# Altium schematic sheet ieee_hart_receiver.schdoc: reciever
size 277 x 295 mm; Device: Altium_Custom(1091*1162); Revision: 1.0; DocumentSize: User; date: 18032008; project: Penguino-STM32WL-LoRa-E5; file: Penguino-STM32WL-LoRa-E5.schdoc; size: User; Name: Altium_Custom(1091*1162); Width: 1091; Height: 1162; X Region Count: 0; Y Region Count: 0; Blade Width: 0; Region Start: 1; Border: 1; Title Block Position: 3
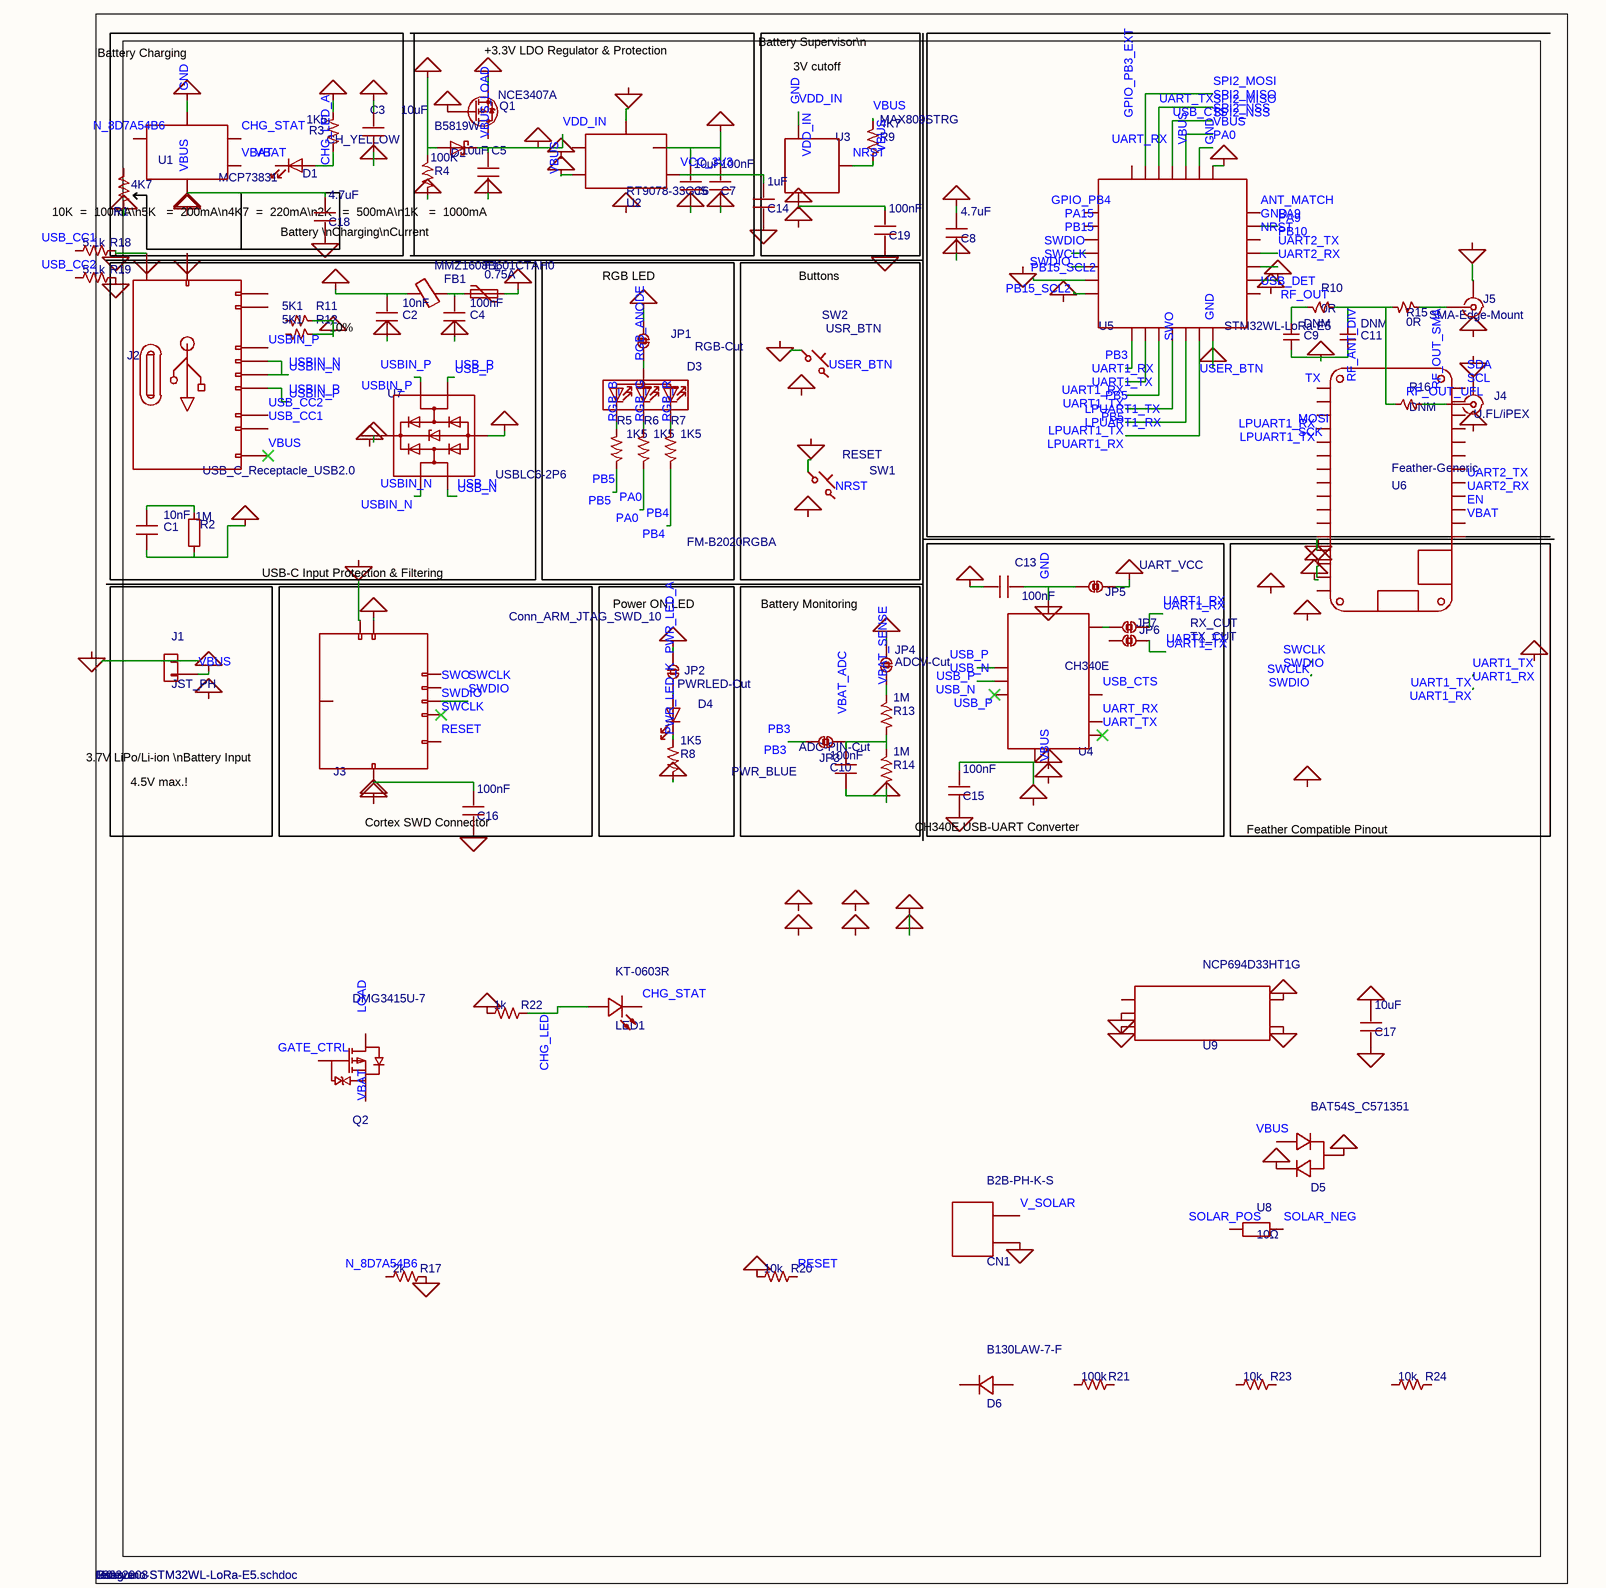
[diagram p0: ieee_hart_receiver.schdoc]

## Parts
C1  value 10nF  (hidden comment: Protoflow:Device_C)
C2  value 10nF  (hidden comment: Protoflow:Device_C_2)
C3  value 10uF  (hidden comment: Protoflow:Device_C_5)
C4  value 100nF  (hidden comment: Protoflow:Device_C_3)
C5  value 10uF  (hidden comment: Protoflow:Device_C_6)
C6  value 10uF  (hidden comment: Protoflow:Device_C_8)
C7  value 100nF  (hidden comment: Protoflow:Device_C_7)
C8  value 4.7uF  (hidden comment: Protoflow:Device_C_10)
C9  value DNM  (hidden comment: Protoflow:Device_C_Small)
C10  value 100nF  (hidden comment: Protoflow:Device_C_4)
C11  value DNM  (hidden comment: Protoflow:Device_C_Small_2)
C13  value 100nF  (hidden comment: Protoflow:Device_C_9)
C14  value 1uF  (hidden comment: Device:C)
C15  value 100nF  (hidden comment: Device:C)
C16  value 100nF  (hidden comment: Device:C)
C17  value 10uF  (hidden comment: Device:C)
C18  value 4.7uF  (hidden comment: Device:C)
C19  value 100nF  (hidden comment: Device:C)
CN1  B2B-PH-K-S
D1  value CH_YELLOW  (hidden comment: Protoflow:Device_LED_ALT_2)
D2  value B5819W  (hidden comment: Protoflow:Diode_MBR0520)
D3  value FM-B2020RGBA  (hidden comment: Protoflow:Penguino-STM32WL-LoRa-E5-rescue_RGB_LED_FM-B2020RGBA-tinylora_v1-TLM-4260-breakout-v1_0-rescue-TinyLoRa-4260-breakout-v1_0-rescu)
D4  value PWR_BLUE  (hidden comment: Protoflow:Device_LED_ALT)
D5  value BAT54S_C571351  (hidden comment: Protoflow:BAT54S_C571351)
D6  value B130LAW-7-F  (hidden comment: Protoflow:B130LAW-7-F)
F1  value 0.75A  (hidden comment: Protoflow:Device_Polyfuse)
FB1  value MMZ1608B601CTAH0  (hidden comment: Protoflow:Device_Ferrite_Bead)
J1  value JST_PH  (hidden comment: Protoflow:Connector_Generic_Conn_01x02)
J2  value USB_C_Receptacle_USB2.0  (hidden comment: Protoflow:Penguino-STM32WL-LoRa-E5-rescue_USB_C_Receptacle_USB2_0-Connector-Penguino-STM32WL-M-rescue)
J3  value Conn_ARM_JTAG_SWD_10  (hidden comment: Protoflow:Connector_Conn_ARM_JTAG_SWD_10)
J4  value U.FL/iPEX  (hidden comment: Protoflow:Connector_Conn_Coaxial)
J5  value SMA-Edge-Mount  (hidden comment: Protoflow:Connector_Conn_Coaxial_2)
JP1  value RGB-Cut  (hidden comment: Protoflow:Jumper_SolderJumper_2_Bridged)
JP2  value PWRLED-Cut  (hidden comment: Protoflow:Jumper_SolderJumper_2_Bridged_2)
JP3  value ADC-PIN-Cut  (hidden comment: Protoflow:Jumper_SolderJumper_2_Bridged_3)
JP4  value ADCV-Cut  (hidden comment: Protoflow:Jumper_SolderJumper_2_Bridged_4)
JP5  value UART_VCC  (hidden comment: Protoflow:Jumper_SolderJumper_2_Bridged_5)
JP6  value RX_CUT  (hidden comment: Protoflow:Jumper_SolderJumper_2_Bridged_7)
JP7  value TX_CUT  (hidden comment: Protoflow:Jumper_SolderJumper_2_Bridged_6)
LED1  value KT-0603R  (hidden comment: Protoflow:KT-0603R)
Q1  value NCE3407A  (hidden comment: Protoflow:Device_Q_PMOS_GSD)
Q2  value DMG3415U-7  (hidden comment: Protoflow:DMG3415U-7)
R1  value 4K7  (hidden comment: Protoflow:Device_R_US_2)
R2  value 1M  (hidden comment: Protoflow:Device_R)
R3  value 1K5  (hidden comment: Protoflow:Device_R_US)
R4  value 100K  (hidden comment: Protoflow:Device_R_US_3)
R5  value 1K5  (hidden comment: Protoflow:Device_R_US_7)
R6  value 1K5  (hidden comment: Protoflow:Device_R_US_8)
R7  value 1K5  (hidden comment: Protoflow:Device_R_US_9)
R8  value 1K5  (hidden comment: Protoflow:Device_R_US_6)
R9  value 4K7  (hidden comment: Protoflow:Device_R_US_10)
R10  value 0R  (hidden comment: Protoflow:Device_R_Small_US)
R11  value 5K1  (hidden comment: Protoflow:Device_R_Small_US_4)
R12  value 5K1  (hidden comment: Protoflow:Device_R_Small_US_5)
R13  value 1M  (hidden comment: Protoflow:Device_R_US_4)
R14  value 1M  (hidden comment: Protoflow:Device_R_US_5)
R15  value 0R  (hidden comment: Protoflow:Device_R_Small_US_3)
R16  value DNM  (hidden comment: Protoflow:Device_R_Small_US_2)
R17  value 2k  (hidden comment: Device:R_US)
R18  value 5.1k  (hidden comment: Device:R_US)
R19  value 5.1k  (hidden comment: Device:R_US)
R20  value 10k  (hidden comment: Device:R_US)
R21  value 100k  (hidden comment: Device:R_US)
R22  value 1k  (hidden comment: Device:R_US)
R23  value 10k  (hidden comment: Device:R_US)
R24  value 10k  (hidden comment: Device:R_US)
SW1  value RESET  (hidden comment: Protoflow:Switch_SW_Push_45deg_2)
SW2  value USR_BTN  (hidden comment: Protoflow:Switch_SW_Push_45deg)
U1  value MCP73831  (hidden comment: Protoflow:Battery_Management_MCP73831-2-OT)
U2  value RT9078-33GJ5  (hidden comment: Protoflow:Regulator_Linear_NCV8114ASN120T1G)
U3  value MAX809STRG  (hidden comment: Protoflow:Power_Supervisor_TPS3839DBZ)
U4  value CH340E  (hidden comment: Protoflow:Interface_USB_CH340E)
U5  value STM32WL-LoRa-E5  (hidden comment: Protoflow:stm32wl-lib-v1_STM32WL-LoRa-E5)
U6  value Feather-Generic  (hidden comment: Protoflow:penguino_v1_Feather-Generic)
U7  value USBLC6-2P6  (hidden comment: Protoflow:Power_Protection_USBLC6-2P6)
U8  value 10Ω  (hidden comment: Protoflow:FR1_2W-10_5_)
U9  value NCP694D33HT1G  (hidden comment: Protoflow:NCP694D33HT1G)

## Blocks framed on the sheet
RGB LED: D3 JP1 R5-R7
Buttons: SW1 SW2
CH340E USB-UART Converter: C13 C15 JP5-JP7 U4
Cortex SWD Connector: C16 J3
Power ON LED: D4 JP2 R8
Battery Monitoring: C10 JP3 JP4 R13 R14

## Nets
+3.3V: C17.1 D5.3(K/A) R20.1 U5.20(PB10) U6.2(3V) U9.5(VOUT)
GND: C13.2 C14.2 C15.2 C16.2 C17.2 C18.2 C19.2 CN1.2 J2.A1(GND) J2.A12(GND) J2.B1(GND) J2.B12(GND) J2.S1(SHIELD) JP5.2(B) R17.2 R18.2 R19.2 U4.3(GND) U6.4(GND) U9.2(GND) U9.3(CE) U9.4(VIN)
power_+3.3V: C2.2 C5.2 C6.2 C7.2 C8.2 D2.1(K) FB1.2 J3.3(GND) J3.5(GND) JP1.1(A) JP2.1(A) JP5.1(A) U2.4(NC)  [also labelled power_PWR_FLAG]
power_+BATT: C3.2 J1.1(Pin_1) JP4.1(A) Q1.2(S)
power_GND: C1.2 C2.1 C3.1 C4.1 C5.1 C6.1 C7.1 C8.1 C9.1 C10.2 C11.1 C13.1 R1.1 R2.2 R4.1 R8.1 R11.2 R12.2 R14.1 U5.14(GND) U5.22(GND)
power_VBUS: D2.2(A) F1.1 R3.2 R4.2 U1.2(VSS) U7.2(GND)
VBAT: D5.2(K) Q1.1(G)
VBUS: R9.2 R22.1 U2.1(IN)
CHG_LED: LED1.1(A) R22.2
LPUART1_RX: U5.23(PA0) U6.14(Rx)  [also labelled USER_BTN]
LPUART1_TX: U5.24(PB13) U6.13(MISO)
PA0: R6.1
PA9: U5.16(GND)
PB3: JP3.1(A)
PB4: R7.1
PB5: R5.1 U5.25(PB9)
PB15_SCL2: U5.2(GND)
RF_ANT_DIV: C11.2 R10.2 R15.1 R16.2
RF_OUT_SMA: J5.1(In) R15.2
SPI2_MISO: U5.10(PB6)
SPI2_NSS: U5.11(PB5)
SWCLK: J3.4(SWDCLK/TCK)
SWDIO: J3.2(SWDIO/TMS) U5.4(PA14)
UART1_RX: JP6.1(A) U5.27(PA10)
UART1_TX: JP7.1(A) U5.26(PB14)
USB_N: U4.2(UD-) U7.3(I/O2)
USB_P: U4.1(UD+) U4.6(TNOW) U7.1(I/O1)
USBIN_N: J2.A6(D+) J2.B7(D-) U7.4(I/O2)
USBIN_P: J2.A7(D-) J2.B6(D+) U7.6(I/O1)
VDD_IN: U3.1(GND)
NetC1_1: C1.1 R2.1
NetC4_2: C4.2 F1.2 FB1.1
NetC9_2: C9.2 R10.1
NetC10_1: C10.1 JP3.2(B) R13.1 R14.2
NetC14_1: C14.1 U2.5(OUT)
NetC15_1: C15.1 U4.10(V3)
NetC16_1: C16.1 J3.1(VTref)
NetC18_1: C18.1 U1.4(VDD)
NetC19_1: C19.1 U3.3(VDD)
NetD1_2: D1.2(A) R3.1
NetD3_1: D3.1(RK) R7.2
NetD3_2: D3.2(BK) R5.2
NetD3_3: D3.3(A) JP1.2(B)
NetD3_4: D3.4(GK) R6.2
NetD4_1: D4.1(K) R8.2
NetD4_2: D4.2(A) JP2.2(B)
NetJ2_A4: J2.A4(VBUS) J2.A9(VBUS) J2.B4(VBUS) J2.B9(VBUS)
NetJ4_1: J4.1(In) R16.1
NetJP4_2: JP4.2(B) R13.2
NetJP6_2: JP6.2(B) U4.4(~{RTS})
NetR9_1: R9.1 U3.2(~{RESET})

Not connected (* = marked no-connect by the designer): CN1 1; D1 1(K); D5 1(A); D6 1 2; J1 2(Pin_2); J2 A5(CC1) A8(SBU1) B5(CC2) B8(SBU2); J3 6(SWO/TDO) 7(KEY) 8(NC/TDI) 9(GNDDetect) 10(~{RESET}); J4 2(Ext); J5 2(Ext); JP7 2(B); LED1 2(K); Q1 3(D); Q2 1(G) 2(D) 3(S); R1 2; R11 1; R12 1; R17 1; R18 1; R19 1; R20 2; R21 1 2; R23 1 2; R24 1 2; SW1 1 2; SW2 1 2; U1 1(STAT) 3(VBAT) 5(PROG); U2 2(GND) 3(EN); U4 5(~{CTS}) 7(VCC) 8(TXD)* 9(RXD); U5 1(VCC) 3(PA13) 5(PB15) 6(PA15) 7(PB4) 8(PB3) 9(PB7) 12(PC1) 13(PC0) 15(RFIO) 17(RST) 18(PA3) 19(PA2) 21(PA9) 28(PB0); U6 1(RST) 3 5 6 7 8 9 10 11(SCK) 12(MOSI) 15(Tx) 16 17(SDA) 18(SCL) 19 20 21 22 23 24 25 26(VBUS) 27(EN) 28(VBAT); U7 5(VBUS); U8 1 2; U9 1(ADJ/NC)

## Notes on the sheet
- Battery Charging
- (near Q1) +3.3V LDO Regulator & Protection
- Battery Supervisor\n
- 3V cutoff
- 10K  =  100mA\n5K   =  200mA\n4K7  =  220mA\n2K   =  500mA\n1K   =  1000mA
- (near C18) Battery \nCharging\nCurrent
- 10%
- USB-C Input Protection & Filtering
- 4.5V max.!
- 3.7V LiPo/Li-ion \nBattery Input
- Feather Compatible Pinout
- Labels drawn without touching a wire or pin: +3.3V, ANT_MATCH, CHG_LED_A, CHG_STAT, EN, GATE_CTRL, GND, GPIO_PB3_EXT, GPIO_PB4, LOAD, LPUART1_RX, LPUART1_TX, MOSI, N_8D7A54B6, NRST, PA0, PA9, PA15, PB3, PB4, PB5, PB10, PB15, PB15_SCL2, power_+3.3V, power_GND, power_PWR_FLAG, power_VBUS, PWR_LED_A, PWR_LED_K, RESET, RF_OUT, RF_OUT_UFL, RGB_ANODE, RGB_B, RGB_G, RGB_R, SCK, SCL, SDA, SOLAR_NEG, SOLAR_POS, SPI2_MISO, SPI2_MOSI, SPI2_NSS, SWCLK, SWDIO, SWO, TX, UART1_RX, UART1_TX, UART2_RX, UART2_TX, UART_RX, UART_TX, USB_CC1, USB_CC2, USB_CTS, USB_DET, USB_N, USB_P, USBIN_N, USBIN_P, USER_BTN, V_SOLAR, VBAT, VBAT_ADC, VBAT_SENSE, VBUS, VBUS_LOAD, VCC_3V3, VDD_IN
- reciever
- 1.0
- User
- 18032008
- Penguino-STM32WL-LoRa-E5
- Penguino-STM32WL-LoRa-E5.schdoc

## Library data of the parts
C1 = Protoflow:Device_C: UniqueId: b4693cfd16d534cd; AddInBom: yes; Device: Protoflow:Device_C; DesignItemID: Protoflow:Device_C; LibraryName: ProtoFlow; SymbolName: Protoflow:Device_C
C2 = Protoflow:Device_C_2: UniqueId: a2c5d49bc5dde298; AddInBom: yes; Device: Protoflow:Device_C_2; DesignItemID: Protoflow:Device_C_2; LibraryName: ProtoFlow; SymbolName: Protoflow:Device_C_2
C3 = Protoflow:Device_C_5: UniqueId: cc82bf2c2e22e605; AddInBom: yes; Device: Protoflow:Device_C_5; DesignItemID: Protoflow:Device_C_5; LibraryName: ProtoFlow; SymbolName: Protoflow:Device_C_5
C4 = Protoflow:Device_C_3: UniqueId: 3a68d3ddabf48558; AddInBom: yes; Device: Protoflow:Device_C_3; DesignItemID: Protoflow:Device_C_3; LibraryName: ProtoFlow; SymbolName: Protoflow:Device_C_3
C5 = Protoflow:Device_C_6: UniqueId: ddba3c46cf8b8e66; AddInBom: yes; Device: Protoflow:Device_C_6; DesignItemID: Protoflow:Device_C_6; LibraryName: ProtoFlow; SymbolName: Protoflow:Device_C_6
C6 = Protoflow:Device_C_8: UniqueId: ab4a8fe24fad9fe4; AddInBom: yes; Device: Protoflow:Device_C_8; DesignItemID: Protoflow:Device_C_8; LibraryName: ProtoFlow; SymbolName: Protoflow:Device_C_8
C7 = Protoflow:Device_C_7: UniqueId: 48d2dd422533522c; AddInBom: yes; Device: Protoflow:Device_C_7; DesignItemID: Protoflow:Device_C_7; LibraryName: ProtoFlow; SymbolName: Protoflow:Device_C_7
C8 = Protoflow:Device_C_10: UniqueId: 80f3708378e3d903; AddInBom: yes; Device: Protoflow:Device_C_10; DesignItemID: Protoflow:Device_C_10; LibraryName: ProtoFlow; SymbolName: Protoflow:Device_C_10
C9 = Protoflow:Device_C_Small: UniqueId: 7ddfd2f632a8b17d; AddInBom: yes; Device: Protoflow:Device_C_Small; DesignItemID: Protoflow:Device_C_Small; LibraryName: ProtoFlow; SymbolName: Protoflow:Device_C_Small
C10 = Protoflow:Device_C_4: UniqueId: 3e75135af30e0f04; AddInBom: yes; Device: Protoflow:Device_C_4; DesignItemID: Protoflow:Device_C_4; LibraryName: ProtoFlow; SymbolName: Protoflow:Device_C_4
C11 = Protoflow:Device_C_Small_2: UniqueId: 20764de07767b3a1; AddInBom: yes; Device: Protoflow:Device_C_Small_2; DesignItemID: Protoflow:Device_C_Small_2; LibraryName: ProtoFlow; SymbolName: Protoflow:Device_C_Small_2
C13 = Protoflow:Device_C_9: UniqueId: e7ba3aba9f9889c8; AddInBom: yes; Device: Protoflow:Device_C_9; DesignItemID: Protoflow:Device_C_9; LibraryName: ProtoFlow; SymbolName: Protoflow:Device_C_9
C14 = Device:C: UniqueId: 00361082df9d4549; AddInBom: yes; Device: Device:C; DesignItemID: Device:C; LibraryName: ProtoFlow; SymbolName: Device:C
C15 = Device:C: UniqueId: 86bb77bda672094d; AddInBom: yes; Device: Device:C; DesignItemID: Device:C; LibraryName: ProtoFlow; SymbolName: Device:C
C16 = Device:C: UniqueId: c8e923f96b539988; AddInBom: yes; Device: Device:C; DesignItemID: Device:C; LibraryName: ProtoFlow; SymbolName: Device:C
C17 = Device:C: UniqueId: 48700c84863a802e; AddInBom: yes; Device: Device:C; DesignItemID: Device:C; LibraryName: ProtoFlow; SymbolName: Device:C
C18 = Device:C: UniqueId: d9d0285421fe3ef0; AddInBom: yes; Device: Device:C; DesignItemID: Device:C; LibraryName: ProtoFlow; SymbolName: Device:C
C19 = Device:C: UniqueId: 9b75bd895f0e39d2; AddInBom: yes; Device: Device:C; DesignItemID: Device:C; LibraryName: ProtoFlow; SymbolName: Device:C
CN1 = B2B-PH-K-S: UniqueId: f8333110677ba079; AddInBom: yes; Device: B2B-PH-K-S; Value: B2B-PH-K-S; DesignItemID: B2B-PH-K-S; LibraryName: ProtoFlow; SymbolName: B2B-PH-K-S
D1 = Protoflow:Device_LED_ALT_2: UniqueId: 6eb2f7ba7a12821c; AddInBom: yes; Device: Protoflow:Device_LED_ALT_2; DesignItemID: Protoflow:Device_LED_ALT_2; LibraryName: ProtoFlow; SymbolName: Protoflow:Device_LED_ALT_2
D2 = Protoflow:Diode_MBR0520: UniqueId: cca08e5caf06c018; AddInBom: yes; Device: Protoflow:Diode_MBR0520; DesignItemID: Protoflow:Diode_MBR0520; LibraryName: ProtoFlow; SymbolName: Protoflow:Diode_MBR0520
D3 = Protoflow:Penguino-STM32WL-LoRa-E5-rescue_RGB_LED_FM-B2020RGBA-tinylora_v1-TLM-4260-breakout-v1_0-rescue-TinyLoRa-4260-breakout-: UniqueId: 81689f1d3303caec; AddInBom: yes; Device: Protoflow:Penguino-STM32WL-LoRa-E5-rescue_RGB_LED_FM-B2020RGBA-tinylora_v1-TLM-4260-breakout-v1_0-rescue-TinyLoRa-4260-breakout-; DesignItemID: Protoflow:Penguino-STM32WL-LoRa-E5-rescue_RGB_LED_FM-B2020RGBA-tinylora_v1-TLM-4260-breakout-v1_0-rescue-TinyLoRa-4260-breakout-v1_0-rescu; LibraryName: ProtoFlow; SymbolName: Protoflow:Penguino-STM32WL-LoRa-E5-rescue_RGB_LED_FM-B2020RGBA-tinylora_v1-TLM-4260-breakout-v1_0-rescue-TinyLoRa-4260-breakout-
D4 = Protoflow:Device_LED_ALT: UniqueId: 6a4368da87585c93; AddInBom: yes; Device: Protoflow:Device_LED_ALT; DesignItemID: Protoflow:Device_LED_ALT; LibraryName: ProtoFlow; SymbolName: Protoflow:Device_LED_ALT
D5 = Protoflow:BAT54S_C571351: UniqueId: aa27cf4c2f614704; AddInBom: yes; Device: Protoflow:BAT54S_C571351; DesignItemID: Protoflow:BAT54S_C571351; LibraryName: ProtoFlow; SymbolName: Protoflow:BAT54S_C571351
D6 = Protoflow:B130LAW-7-F: UniqueId: 0b466d7a0d9696a1; AddInBom: yes; Device: Protoflow:B130LAW-7-F; DesignItemID: Protoflow:B130LAW-7-F; LibraryName: ProtoFlow; SymbolName: Protoflow:B130LAW-7-F
F1 = Protoflow:Device_Polyfuse: UniqueId: 09f31a4987c8a883; AddInBom: yes; Device: Protoflow:Device_Polyfuse; DesignItemID: Protoflow:Device_Polyfuse; LibraryName: ProtoFlow; SymbolName: Protoflow:Device_Polyfuse
FB1 = Protoflow:Device_Ferrite_Bead: UniqueId: 323bb55b4674cf0d; AddInBom: yes; Device: Protoflow:Device_Ferrite_Bead; DesignItemID: Protoflow:Device_Ferrite_Bead; LibraryName: ProtoFlow; SymbolName: Protoflow:Device_Ferrite_Bead
J1 = Protoflow:Connector_Generic_Conn_01x02: UniqueId: 51bfc0e5166a1c40; AddInBom: yes; Device: Protoflow:Connector_Generic_Conn_01x02; DesignItemID: Protoflow:Connector_Generic_Conn_01x02; LibraryName: ProtoFlow; SymbolName: Protoflow:Connector_Generic_Conn_01x02
J2 = Protoflow:Penguino-STM32WL-LoRa-E5-rescue_USB_C_Receptacle_USB2_0-Connector-Penguino-STM32WL-M-rescue: UniqueId: 1fb9863844ab5169; AddInBom: yes; Device: Protoflow:Penguino-STM32WL-LoRa-E5-rescue_USB_C_Receptacle_USB2_0-Connector-Penguino-STM32WL-M-rescue; DesignItemID: Protoflow:Penguino-STM32WL-LoRa-E5-rescue_USB_C_Receptacle_USB2_0-Connector-Penguino-STM32WL-M-rescue; LibraryName: ProtoFlow; SymbolName: Protoflow:Penguino-STM32WL-LoRa-E5-rescue_USB_C_Receptacle_USB2_0-Connector-Penguino-STM32WL-M-rescue
J3 = Protoflow:Connector_Conn_ARM_JTAG_SWD_10: UniqueId: bd3ee0abdb58119f; AddInBom: yes; Device: Protoflow:Connector_Conn_ARM_JTAG_SWD_10; DesignItemID: Protoflow:Connector_Conn_ARM_JTAG_SWD_10; LibraryName: ProtoFlow; SymbolName: Protoflow:Connector_Conn_ARM_JTAG_SWD_10
J4 = Protoflow:Connector_Conn_Coaxial: UniqueId: 7aadee231938cadd; AddInBom: yes; Device: Protoflow:Connector_Conn_Coaxial; DesignItemID: Protoflow:Connector_Conn_Coaxial; LibraryName: ProtoFlow; SymbolName: Protoflow:Connector_Conn_Coaxial
J5 = Protoflow:Connector_Conn_Coaxial_2: UniqueId: 188f82074eb8ca32; AddInBom: yes; Device: Protoflow:Connector_Conn_Coaxial_2; DesignItemID: Protoflow:Connector_Conn_Coaxial_2; LibraryName: ProtoFlow; SymbolName: Protoflow:Connector_Conn_Coaxial_2
JP1 = Protoflow:Jumper_SolderJumper_2_Bridged: UniqueId: 4fe8deccf3ecd12b; AddInBom: yes; Device: Protoflow:Jumper_SolderJumper_2_Bridged; DesignItemID: Protoflow:Jumper_SolderJumper_2_Bridged; LibraryName: ProtoFlow; SymbolName: Protoflow:Jumper_SolderJumper_2_Bridged
JP2 = Protoflow:Jumper_SolderJumper_2_Bridged_2: UniqueId: 12cb931c49908c91; AddInBom: yes; Device: Protoflow:Jumper_SolderJumper_2_Bridged_2; DesignItemID: Protoflow:Jumper_SolderJumper_2_Bridged_2; LibraryName: ProtoFlow; SymbolName: Protoflow:Jumper_SolderJumper_2_Bridged_2
JP3 = Protoflow:Jumper_SolderJumper_2_Bridged_3: UniqueId: 4577e3d3da87c365; AddInBom: yes; Device: Protoflow:Jumper_SolderJumper_2_Bridged_3; DesignItemID: Protoflow:Jumper_SolderJumper_2_Bridged_3; LibraryName: ProtoFlow; SymbolName: Protoflow:Jumper_SolderJumper_2_Bridged_3
JP4 = Protoflow:Jumper_SolderJumper_2_Bridged_4: UniqueId: d84cd54a2cd93ea0; AddInBom: yes; Device: Protoflow:Jumper_SolderJumper_2_Bridged_4; DesignItemID: Protoflow:Jumper_SolderJumper_2_Bridged_4; LibraryName: ProtoFlow; SymbolName: Protoflow:Jumper_SolderJumper_2_Bridged_4
JP5 = Protoflow:Jumper_SolderJumper_2_Bridged_5: UniqueId: 7ff5f6d6ea161ff3; AddInBom: yes; Device: Protoflow:Jumper_SolderJumper_2_Bridged_5; DesignItemID: Protoflow:Jumper_SolderJumper_2_Bridged_5; LibraryName: ProtoFlow; SymbolName: Protoflow:Jumper_SolderJumper_2_Bridged_5
JP6 = Protoflow:Jumper_SolderJumper_2_Bridged_7: UniqueId: 1e4a53fbbd604e66; AddInBom: yes; Device: Protoflow:Jumper_SolderJumper_2_Bridged_7; DesignItemID: Protoflow:Jumper_SolderJumper_2_Bridged_7; LibraryName: ProtoFlow; SymbolName: Protoflow:Jumper_SolderJumper_2_Bridged_7
JP7 = Protoflow:Jumper_SolderJumper_2_Bridged_6: UniqueId: 2c2198ed19c983b6; AddInBom: yes; Device: Protoflow:Jumper_SolderJumper_2_Bridged_6; DesignItemID: Protoflow:Jumper_SolderJumper_2_Bridged_6; LibraryName: ProtoFlow; SymbolName: Protoflow:Jumper_SolderJumper_2_Bridged_6
LED1 = Protoflow:KT-0603R: UniqueId: 7a65b453ee5a9ec2; AddInBom: yes; Device: Protoflow:KT-0603R; DesignItemID: Protoflow:KT-0603R; LibraryName: ProtoFlow; SymbolName: Protoflow:KT-0603R
Q1 = Protoflow:Device_Q_PMOS_GSD: UniqueId: f76c01de5337d462; AddInBom: yes; Device: Protoflow:Device_Q_PMOS_GSD; DesignItemID: Protoflow:Device_Q_PMOS_GSD; LibraryName: ProtoFlow; SymbolName: Protoflow:Device_Q_PMOS_GSD
Q2 = Protoflow:DMG3415U-7: UniqueId: 4c27cd76e8dbac26; AddInBom: yes; Device: Protoflow:DMG3415U-7; DesignItemID: Protoflow:DMG3415U-7; LibraryName: ProtoFlow; SymbolName: Protoflow:DMG3415U-7
R1 = Protoflow:Device_R_US_2: UniqueId: 353b166cc2dee846; AddInBom: yes; Device: Protoflow:Device_R_US_2; DesignItemID: Protoflow:Device_R_US_2; LibraryName: ProtoFlow; SymbolName: Protoflow:Device_R_US_2
R2 = Protoflow:Device_R: UniqueId: 6f63fc6711cfa315; AddInBom: yes; Device: Protoflow:Device_R; DesignItemID: Protoflow:Device_R; LibraryName: ProtoFlow; SymbolName: Protoflow:Device_R
R3 = Protoflow:Device_R_US: UniqueId: fe89d0632cfce75f; AddInBom: yes; Device: Protoflow:Device_R_US; DesignItemID: Protoflow:Device_R_US; LibraryName: ProtoFlow; SymbolName: Protoflow:Device_R_US
R4 = Protoflow:Device_R_US_3: UniqueId: fdc86a4b576d9e98; AddInBom: yes; Device: Protoflow:Device_R_US_3; DesignItemID: Protoflow:Device_R_US_3; LibraryName: ProtoFlow; SymbolName: Protoflow:Device_R_US_3
R5 = Protoflow:Device_R_US_7: UniqueId: 9cdd622c9eeecfe7; AddInBom: yes; Device: Protoflow:Device_R_US_7; DesignItemID: Protoflow:Device_R_US_7; LibraryName: ProtoFlow; SymbolName: Protoflow:Device_R_US_7
R6 = Protoflow:Device_R_US_8: UniqueId: e06ccd13940482ac; AddInBom: yes; Device: Protoflow:Device_R_US_8; DesignItemID: Protoflow:Device_R_US_8; LibraryName: ProtoFlow; SymbolName: Protoflow:Device_R_US_8
R7 = Protoflow:Device_R_US_9: UniqueId: ba2c6d155e7fd301; AddInBom: yes; Device: Protoflow:Device_R_US_9; DesignItemID: Protoflow:Device_R_US_9; LibraryName: ProtoFlow; SymbolName: Protoflow:Device_R_US_9
R8 = Protoflow:Device_R_US_6: UniqueId: 86d447fa2a9c8586; AddInBom: yes; Device: Protoflow:Device_R_US_6; DesignItemID: Protoflow:Device_R_US_6; LibraryName: ProtoFlow; SymbolName: Protoflow:Device_R_US_6
R9 = Protoflow:Device_R_US_10: UniqueId: 1e1ffada38203b9e; AddInBom: yes; Device: Protoflow:Device_R_US_10; DesignItemID: Protoflow:Device_R_US_10; LibraryName: ProtoFlow; SymbolName: Protoflow:Device_R_US_10
R10 = Protoflow:Device_R_Small_US: UniqueId: 41bc0941336b1513; AddInBom: yes; Device: Protoflow:Device_R_Small_US; DesignItemID: Protoflow:Device_R_Small_US; LibraryName: ProtoFlow; SymbolName: Protoflow:Device_R_Small_US
R11 = Protoflow:Device_R_Small_US_4: UniqueId: 763cf8d5648cb4fd; AddInBom: yes; Device: Protoflow:Device_R_Small_US_4; DesignItemID: Protoflow:Device_R_Small_US_4; LibraryName: ProtoFlow; SymbolName: Protoflow:Device_R_Small_US_4
R12 = Protoflow:Device_R_Small_US_5: UniqueId: 15ac9218146e0f4b; AddInBom: yes; Device: Protoflow:Device_R_Small_US_5; DesignItemID: Protoflow:Device_R_Small_US_5; LibraryName: ProtoFlow; SymbolName: Protoflow:Device_R_Small_US_5
R13 = Protoflow:Device_R_US_4: UniqueId: ff4077a9ca69db92; AddInBom: yes; Device: Protoflow:Device_R_US_4; DesignItemID: Protoflow:Device_R_US_4; LibraryName: ProtoFlow; SymbolName: Protoflow:Device_R_US_4
R14 = Protoflow:Device_R_US_5: UniqueId: 8b54177fc4d64d35; AddInBom: yes; Device: Protoflow:Device_R_US_5; DesignItemID: Protoflow:Device_R_US_5; LibraryName: ProtoFlow; SymbolName: Protoflow:Device_R_US_5
R15 = Protoflow:Device_R_Small_US_3: UniqueId: feece054417b9159; AddInBom: yes; Device: Protoflow:Device_R_Small_US_3; DesignItemID: Protoflow:Device_R_Small_US_3; LibraryName: ProtoFlow; SymbolName: Protoflow:Device_R_Small_US_3
R16 = Protoflow:Device_R_Small_US_2: UniqueId: 3c543c7c58e1cc80; AddInBom: yes; Device: Protoflow:Device_R_Small_US_2; DesignItemID: Protoflow:Device_R_Small_US_2; LibraryName: ProtoFlow; SymbolName: Protoflow:Device_R_Small_US_2
R17 = Device:R_US: UniqueId: 6346d187b4e0bc9c; AddInBom: yes; Device: Device:R_US; DesignItemID: Device:R_US; LibraryName: ProtoFlow; SymbolName: Device:R_US
R18 = Device:R_US: UniqueId: 5f673669f0d56d8f; AddInBom: yes; Device: Device:R_US; DesignItemID: Device:R_US; LibraryName: ProtoFlow; SymbolName: Device:R_US
R19 = Device:R_US: UniqueId: a32210a39874d8f8; AddInBom: yes; Device: Device:R_US; DesignItemID: Device:R_US; LibraryName: ProtoFlow; SymbolName: Device:R_US
R20 = Device:R_US: UniqueId: 13e77c54ede4b306; AddInBom: yes; Device: Device:R_US; DesignItemID: Device:R_US; LibraryName: ProtoFlow; SymbolName: Device:R_US
R21 = Device:R_US: UniqueId: c77b08197b178948; AddInBom: yes; Device: Device:R_US; DesignItemID: Device:R_US; LibraryName: ProtoFlow; SymbolName: Device:R_US
R22 = Device:R_US: UniqueId: fa394caafc8878d8; AddInBom: yes; Device: Device:R_US; DesignItemID: Device:R_US; LibraryName: ProtoFlow; SymbolName: Device:R_US
R23 = Device:R_US: UniqueId: d92c635076b33213; AddInBom: yes; Device: Device:R_US; DesignItemID: Device:R_US; LibraryName: ProtoFlow; SymbolName: Device:R_US
R24 = Device:R_US: UniqueId: f7952e9f9cd6773b; AddInBom: yes; Device: Device:R_US; DesignItemID: Device:R_US; LibraryName: ProtoFlow; SymbolName: Device:R_US
SW1 = Protoflow:Switch_SW_Push_45deg_2: UniqueId: c39dab7994ba8bcb; AddInBom: yes; Device: Protoflow:Switch_SW_Push_45deg_2; DesignItemID: Protoflow:Switch_SW_Push_45deg_2; LibraryName: ProtoFlow; SymbolName: Protoflow:Switch_SW_Push_45deg_2
SW2 = Protoflow:Switch_SW_Push_45deg: UniqueId: 5cf9f4a776b330ee; AddInBom: yes; Device: Protoflow:Switch_SW_Push_45deg; DesignItemID: Protoflow:Switch_SW_Push_45deg; LibraryName: ProtoFlow; SymbolName: Protoflow:Switch_SW_Push_45deg
U1 = Protoflow:Battery_Management_MCP73831-2-OT: UniqueId: 1bdc0ab44f99f92d; AddInBom: yes; Device: Protoflow:Battery_Management_MCP73831-2-OT; DesignItemID: Protoflow:Battery_Management_MCP73831-2-OT; LibraryName: ProtoFlow; SymbolName: Protoflow:Battery_Management_MCP73831-2-OT
U2 = Protoflow:Regulator_Linear_NCV8114ASN120T1G: UniqueId: 48f0ae2437312dae; AddInBom: yes; Device: Protoflow:Regulator_Linear_NCV8114ASN120T1G; DesignItemID: Protoflow:Regulator_Linear_NCV8114ASN120T1G; LibraryName: ProtoFlow; SymbolName: Protoflow:Regulator_Linear_NCV8114ASN120T1G
U3 = Protoflow:Power_Supervisor_TPS3839DBZ: UniqueId: 66797bcd97f4f6c2; AddInBom: yes; Device: Protoflow:Power_Supervisor_TPS3839DBZ; DesignItemID: Protoflow:Power_Supervisor_TPS3839DBZ; LibraryName: ProtoFlow; SymbolName: Protoflow:Power_Supervisor_TPS3839DBZ
U4 = Protoflow:Interface_USB_CH340E: UniqueId: bac468049775df37; AddInBom: yes; Device: Protoflow:Interface_USB_CH340E; DesignItemID: Protoflow:Interface_USB_CH340E; LibraryName: ProtoFlow; SymbolName: Protoflow:Interface_USB_CH340E
U5 = Protoflow:stm32wl-lib-v1_STM32WL-LoRa-E5: UniqueId: adf583383e4d69d4; AddInBom: yes; Device: Protoflow:stm32wl-lib-v1_STM32WL-LoRa-E5; DesignItemID: Protoflow:stm32wl-lib-v1_STM32WL-LoRa-E5; LibraryName: ProtoFlow; SymbolName: Protoflow:stm32wl-lib-v1_STM32WL-LoRa-E5
U6 = Protoflow:penguino_v1_Feather-Generic: AddInBom: yes; Device: Protoflow:penguino_v1_Feather-Generic; DesignItemID: Protoflow:penguino_v1_Feather-Generic; LibraryName: ProtoFlow; Symbol: Protoflow:penguino_v1_Feather-Generic
U7 = Protoflow:Power_Protection_USBLC6-2P6: UniqueId: 4ec783ed4741de1f; AddInBom: yes; Device: Protoflow:Power_Protection_USBLC6-2P6; DesignItemID: Protoflow:Power_Protection_USBLC6-2P6; LibraryName: ProtoFlow; SymbolName: Protoflow:Power_Protection_USBLC6-2P6
U8 = Protoflow:FR1_2W-10_5_: UniqueId: 484e3008dca2bfa8; AddInBom: yes; Device: Protoflow:FR1_2W-10_5_; DesignItemID: Protoflow:FR1_2W-10_5_; LibraryName: ProtoFlow; SymbolName: Protoflow:FR1_2W-10_5_
U9 = Protoflow:NCP694D33HT1G: UniqueId: 2dbbb3175ebf36d7; AddInBom: yes; Device: Protoflow:NCP694D33HT1G; DesignItemID: Protoflow:NCP694D33HT1G; LibraryName: ProtoFlow; SymbolName: Protoflow:NCP694D33HT1G